# Altium schematic sheet Lvl_Shifters.SchDoc
size A3
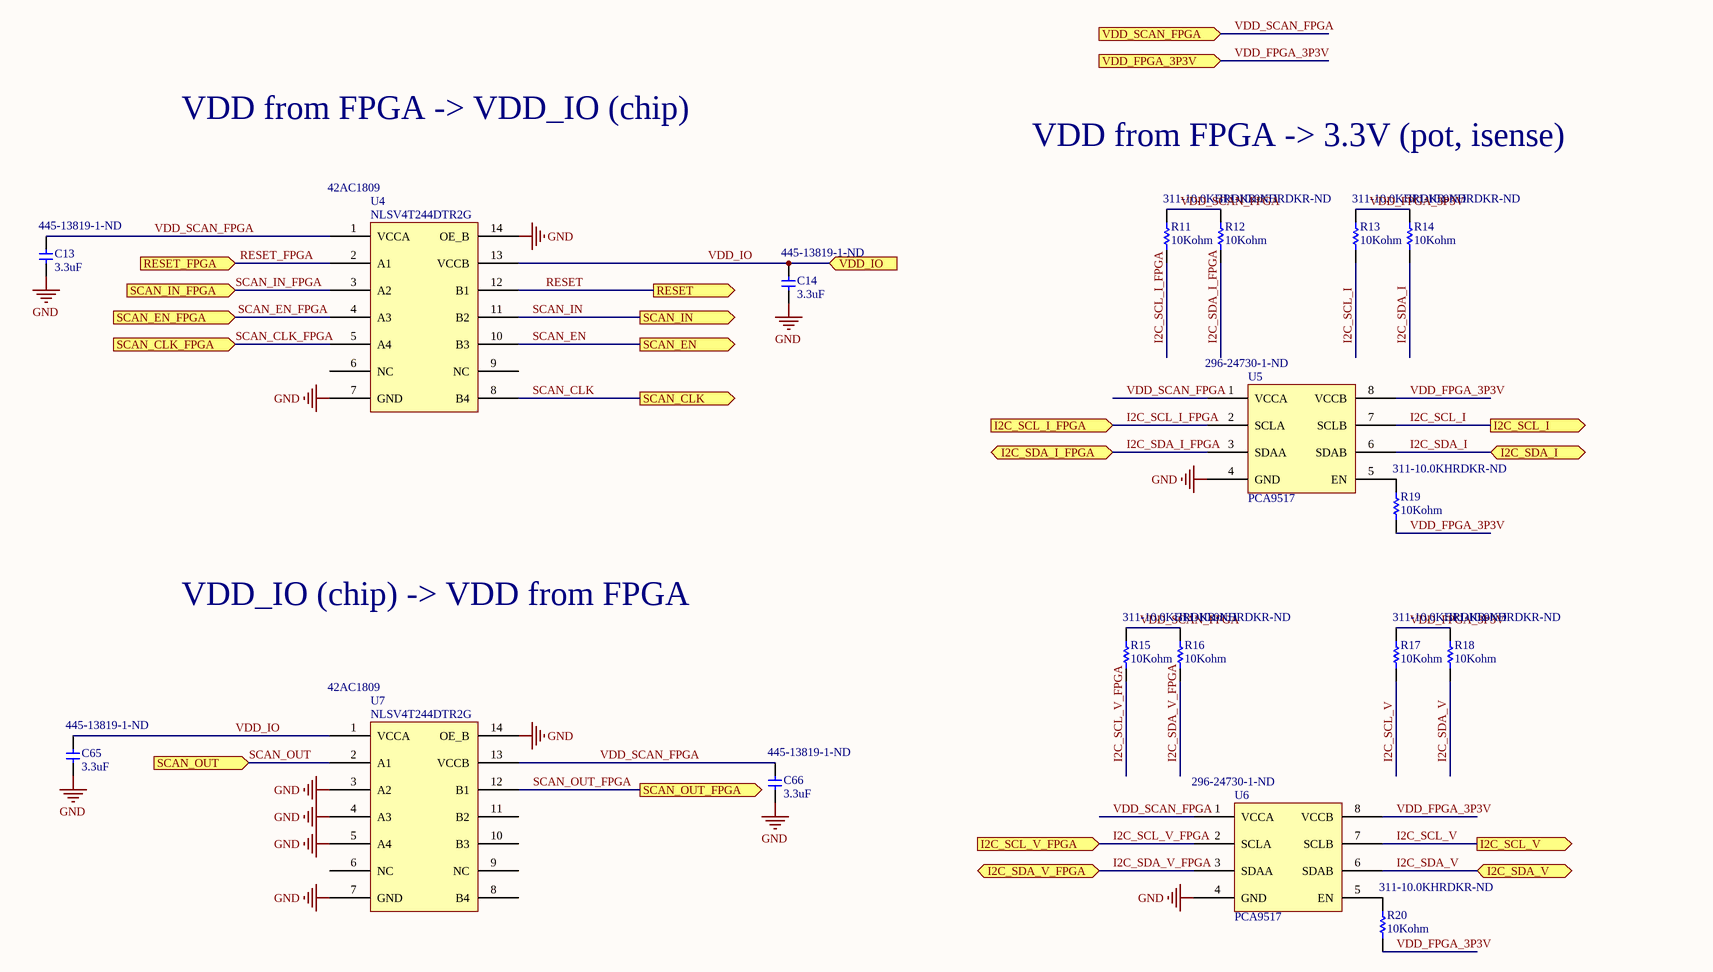
[diagram p0: Lvl_Shifters.SchDoc]

## Parts
C13  3.3uF  Supplier Part Number 1: 445-13819-1-ND  [CAP_0402]
C14  3.3uF  Supplier Part Number 1: 445-13819-1-ND  [CAP_0402]
C65  3.3uF  Supplier Part Number 1: 445-13819-1-ND  [CAP_0402]
C66  3.3uF  Supplier Part Number 1: 445-13819-1-ND  [CAP_0402]
R11  10Kohm  Supplier Part Number 1: 311-10.0KHRDKR-ND  [RES_0603]
R12  10Kohm  Supplier Part Number 1: 311-10.0KHRDKR-ND  [RES_0603]
R13  10Kohm  Supplier Part Number 1: 311-10.0KHRDKR-ND  [RES_0603]
R14  10Kohm  Supplier Part Number 1: 311-10.0KHRDKR-ND  [RES_0603]
R15  10Kohm  Supplier Part Number 1: 311-10.0KHRDKR-ND  [RES_0603]
R16  10Kohm  Supplier Part Number 1: 311-10.0KHRDKR-ND  [RES_0603]
R17  10Kohm  Supplier Part Number 1: 311-10.0KHRDKR-ND  [RES_0603]
R18  10Kohm  Supplier Part Number 1: 311-10.0KHRDKR-ND  [RES_0603]
R19  10Kohm  Supplier Part Number 1: 311-10.0KHRDKR-ND  [RES_0603]
R20  10Kohm  Supplier Part Number 1: 311-10.0KHRDKR-ND  [RES_0603]
U4  NLSV4T244DTR2G  Supplier Part Number 1: 42AC1809  [948G-01]
U5  PCA9517  Supplier Part Number 1: 296-24730-1-ND  [PCA9517]
U6  PCA9517  Supplier Part Number 1: 296-24730-1-ND  [PCA9517]
U7  NLSV4T244DTR2G  Supplier Part Number 1: 42AC1809  [948G-01]

## Ports
I2C_SCL_I (out), I2C_SCL_I_FPGA (in), I2C_SCL_V (out), I2C_SCL_V_FPGA (in), I2C_SDA_I (bidir), I2C_SDA_I_FPGA (bidir), I2C_SDA_V (bidir), I2C_SDA_V_FPGA (bidir), RESET (out), RESET_FPGA (in), SCAN_CLK (out), SCAN_CLK_FPGA (in), SCAN_EN (out), SCAN_EN_FPGA (in), SCAN_IN (out), SCAN_IN_FPGA (in), SCAN_OUT (in), SCAN_OUT_FPGA (out), VDD_FPGA_3P3V (in), VDD_IO (in), VDD_SCAN_FPGA (in)

## Nets
GND: C13.2 C14.2 C65.2 C66.2 U4.7(GND) U4.14(OE_B) U5.4(GND) U6.4(GND) U7.3(A2) U7.4(A3) U7.5(A4) U7.7(GND) U7.14(OE_B)
I2C_SCL_I: R13.2(BOT) U5.7(SCLB) ; port I2C_SCL_I
I2C_SCL_I_FPGA: R11.2(BOT) U5.2(SCLA) ; port I2C_SCL_I_FPGA
I2C_SCL_V: R17.2(BOT) U6.7(SCLB) ; port I2C_SCL_V
I2C_SCL_V_FPGA: R15.2(BOT) U6.2(SCLA) ; port I2C_SCL_V_FPGA
I2C_SDA_I: R14.2(BOT) U5.6(SDAB) ; port I2C_SDA_I
I2C_SDA_I_FPGA: R12.2(BOT) U5.3(SDAA) ; port I2C_SDA_I_FPGA
I2C_SDA_V: R18.2(BOT) U6.6(SDAB) ; port I2C_SDA_V
I2C_SDA_V_FPGA: R16.2(BOT) U6.3(SDAA) ; port I2C_SDA_V_FPGA
RESET: U4.12(B1) ; port RESET
RESET_FPGA: U4.2(A1) ; port RESET_FPGA
SCAN_CLK: U4.8(B4) ; port SCAN_CLK
SCAN_CLK_FPGA: U4.5(A4) ; port SCAN_CLK_FPGA
SCAN_EN: U4.10(B3) ; port SCAN_EN
SCAN_EN_FPGA: U4.4(A3) ; port SCAN_EN_FPGA
SCAN_IN: U4.11(B2) ; port SCAN_IN
SCAN_IN_FPGA: U4.3(A2) ; port SCAN_IN_FPGA
SCAN_OUT: U7.2(A1) ; port SCAN_OUT
SCAN_OUT_FPGA: U7.12(B1) ; port SCAN_OUT_FPGA
VDD_FPGA_3P3V: R13.1(TOP) R14.1(TOP) R17.1(TOP) R18.1(TOP) R19.2(BOT) R20.2(BOT) U5.8(VCCB) U6.8(VCCB) ; port VDD_FPGA_3P3V
VDD_IO: C14.1 C65.1 U4.13(VCCB) U7.1(VCCA) ; port VDD_IO
VDD_SCAN_FPGA: C13.1 C66.1 R11.1(TOP) R12.1(TOP) R15.1(TOP) R16.1(TOP) U4.1(VCCA) U5.1(VCCA) U6.1(VCCA) U7.13(VCCB) ; port VDD_SCAN_FPGA
NetR19_1: R19.1(TOP) U5.5(EN)
NetR20_1: R20.1(TOP) U6.5(EN)

Not connected (* = marked no-connect by the designer): U4 6(NC) 9(NC); U7 6(NC) 8(B4) 9(NC) 10(B3) 11(B2)

## Notes on the sheet
- VDD from FPGA -> VDD_IO (chip)
- VDD from FPGA -> 3.3V (pot, isense)
- VDD_IO (chip) -> VDD from FPGA

## Library data of the parts
C13 C14 C65 C66 = cap 3p3uF: CAP CER 3.3uF 10% 10V X5R 0402; Manufacturer: TDK; Manufacturer ID: C1005X5R1A335K050BC; Digikey ID: 445-13819-1-ND; Value: 3.3uF; Package: 0402; Supplier 1: Digi-Key
R11-R20 = res 10 kOhm_1: RES SMD 10k OHM 1% 1/10W 0603; Package: 0603; Supplier 1: Digi-Key; Supplier 2: Digi-Key; Supplier Part Number 2: 541-10.0KHCT-ND
U4 U7 = NLSV4T244: Voltage Level Translator Unidirectional 1 Circuit 4 Channel 14-TSSOP; Manufacturer: ON Semiconductor; Voltage Range: 0.9V-4.5V; Num. Channels: 4; Manufacturer ID: NLSV4T244DTR2G; Digikey ID: NLSV4T244DTR2GOSCT-ND; Package: TSSOP−14; Supplier 1: Newark
U5 U6 = PCA9517: I2C Repeater, Buffer, ReDriver 2 Channel 400kHz 8-VSSOP; Manufacturer: TI; Manufacturer ID: PCA9517DGKR; Voltage Range B: 2.7V-5.5V; Voltage Range A: 0.9V-5.5V; Digikey ID: 296-24730-1-ND; Package: 8-VSSOP; Supplier 1: Digi-Key